# EAGLE design decoder (EAGLE 7.2.0)
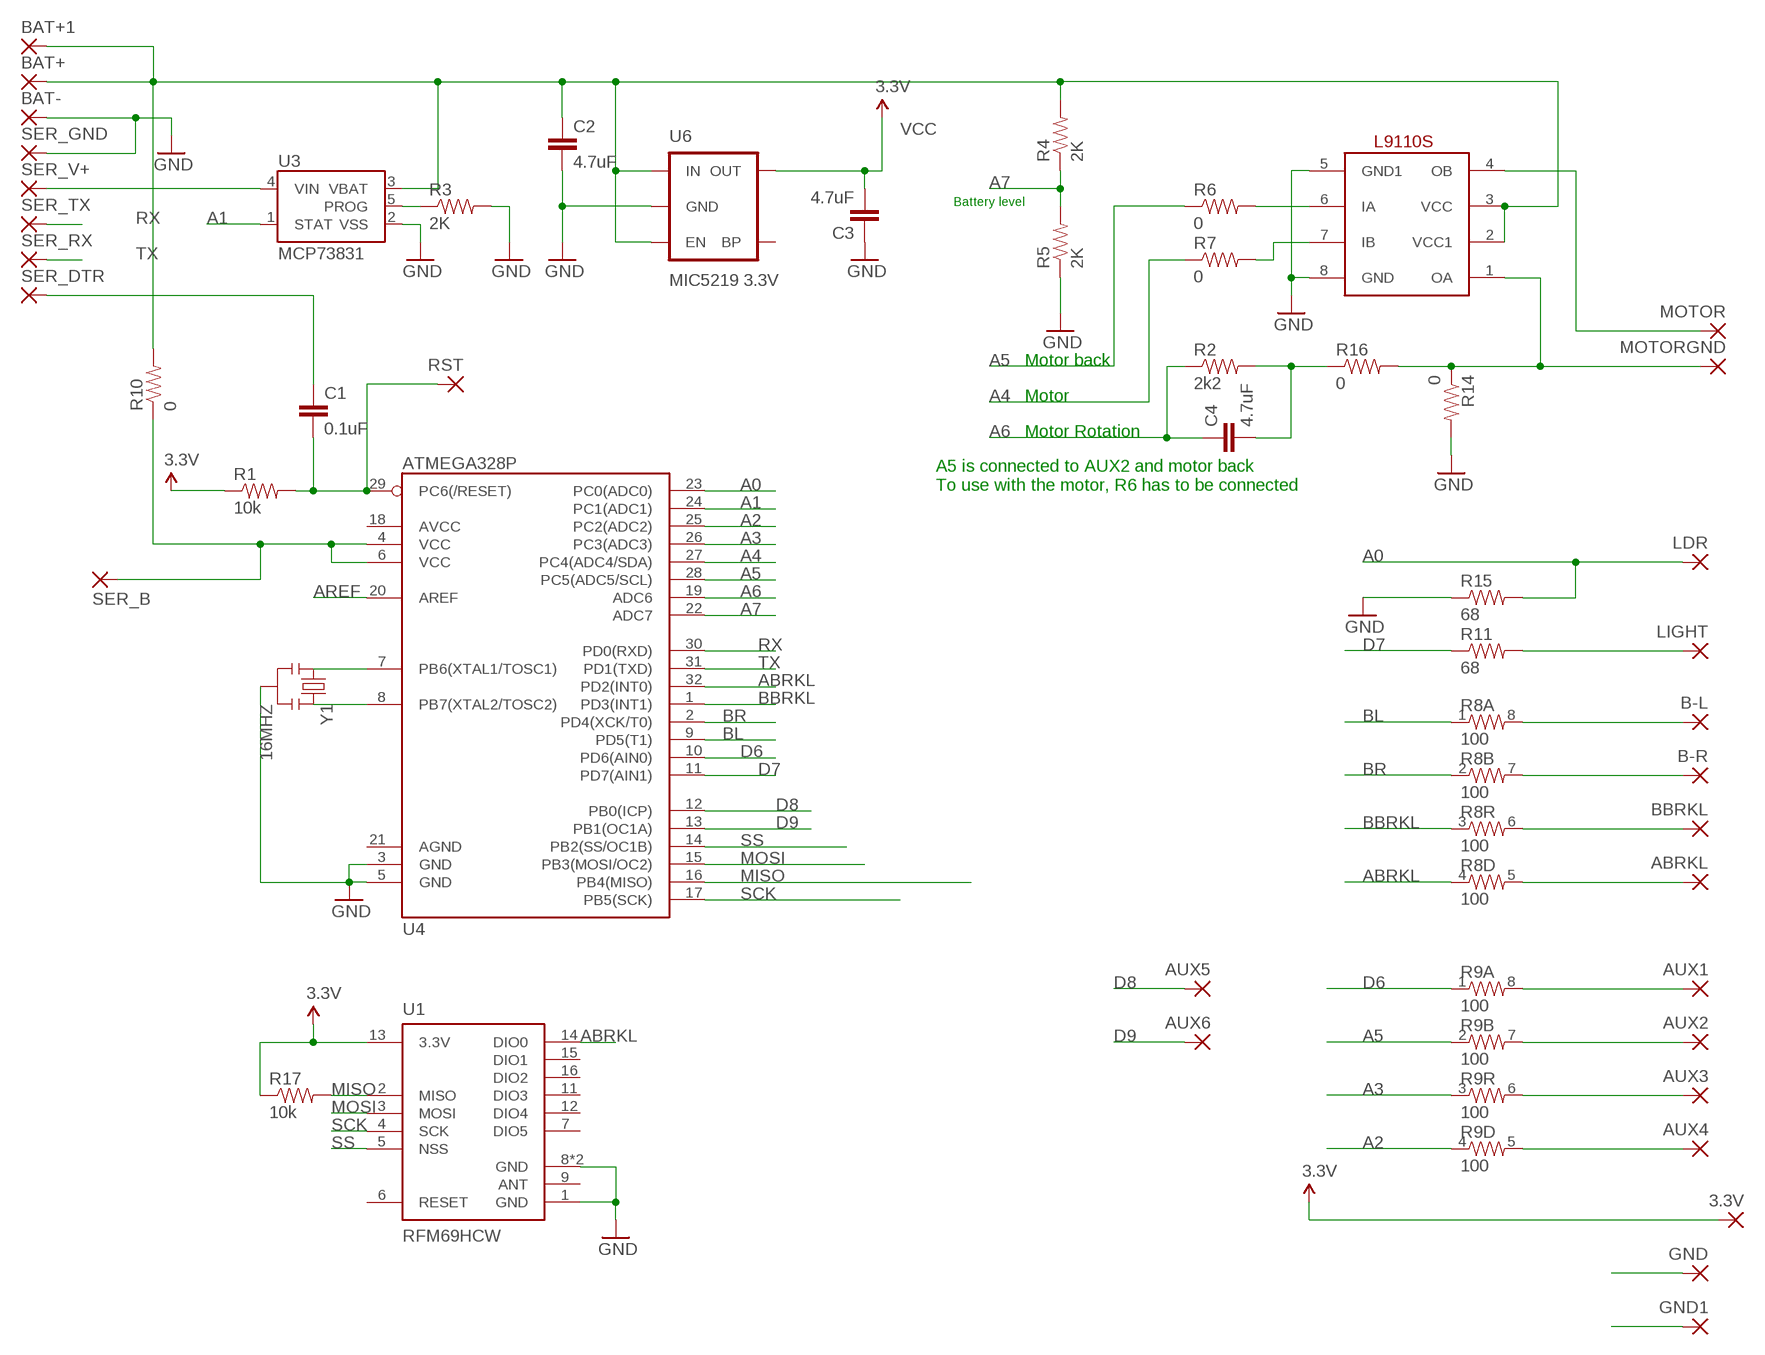
[diagram p0: schematic, sheet 1]

## Parts
3.3V  SMD2  [SMD1,27-2,54]
ABRKL  SMD2  [SMD1,27-2,54]
AUX1  SMD2  [SMD1,27-2,54]
AUX2  SMD2  [SMD1,27-2,54]
AUX3  SMD2  [SMD1,27-2,54]
AUX4  SMD2  [SMD1,27-2,54]
AUX5  SMD2  [SMD1,27-2,54]
AUX6  SMD2  [SMD1,27-2,54]
B-L  SMD2  [SMD1,27-2,54]
B-R  SMD2  [SMD1,27-2,54]
BAT+  SMD2  [SMD1,27-2,54]
BAT+1  SMD2  [SMD1,27-2,54]
BAT-  SMD2  [SMD1,27-2,54]
BBRKL  SMD2  [SMD1,27-2,54]
C1  0.1uF  CAP0805  [0805]
C2  4.7uF  CAP0805  [0805]
C3  4.7uF  CAP0805  [0805]
C4  4.7uF  CAP0805  [0805]
GND  SMD2  [SMD1,27-2,54]
GND1  SMD2  [SMD1,27-2,54]
LDR  SMD2  [SMD1,27-2,54]
LIGHT  SMD2  [SMD1,27-2,54]
MDRIVER  L9110S  [SO08]
MOTOR  SMD2  [SMD1,27-2,54]
MOTORGND  SMD2  [SMD1,27-2,54]
R1  10k  RESISTOR0603-RES  [0603-RES]
R2  2k2  RESISTOR0603-RES  [0603-RES]
R3  2K  RESISTOR0603-RES  [0603-RES]
R4  2K  RESISTOR0603-RES  [0603-RES]
R5  2K  RESISTOR0603-RES  [0603-RES]
R6  0  RESISTOR0603-RES  [0603-RES]
R7  0  RESISTOR0603-RES  [0603-RES]
R8  100  RESISTOR-ARRAY0603-ARV  [0603-ARV]
R9  100  RESISTOR-ARRAY0603-ARV  [0603-ARV]
R10  0  RESISTOR0603-RES  [0603-RES]
R11  68  RESISTOR0603-RES  [0603-RES]
R14  0  RESISTOR0603-RES  [0603-RES]
R15  68  RESISTOR0603-RES  [0603-RES]
R16  0  RESISTOR0603-RES  [0603-RES]
R17  10k  RESISTOR0603-RES  [0603-RES]
RST  SMD2  [SMD1,27-2,54]
SER_B  SMD2  [SMD1,27-2,54]
SER_DTR  SMD2  [SMD1,27-2,54]
SER_GND  SMD2  [SMD1,27-2,54]
SER_RX  SMD2  [SMD1,27-2,54]
SER_TX  SMD2  [SMD1,27-2,54]
SER_V+  SMD2  [SMD1,27-2,54]
U1  RFM69HCW  [RFM69HCW-XXXS2]
U3  MCP73831  [SOT23-5]
U4  ATMEGA328P  ATMEGA328_SMT  [TQFP32-08]
U6  MIC5219 3.3V  V_REG_MIC52193.3V  [SOT23-5]
Y1  16MHZ  RESONATOR16MHZ  [RESONATOR-SMD]

## Nets
A0: LDR.1(P) R15.2 U4.23(PC0(ADC0))
A1: U3.1(STAT) U4.24(PC1(ADC1))
A2: R9.4 U4.25(PC2(ADC2))
A3: R9.3 U4.26(PC3(ADC3))
A4: R7.1 U4.27(PC4(ADC4/SDA))
A5: R6.1 R9.2 U4.28(PC5(ADC5/SCL))
A6: C4.1 R2.1 U4.19(ADC6)
A7: R4.1 R5.2 U4.22(ADC7)
ABRKL: R8.4 U1.14(DIO0) U4.32(PD2(INT0))
AREF: U4.20(AREF)
BAT+: BAT+1.1(P) BAT+.1(P) C2.1 MDRIVER.2(VCC1) MDRIVER.3(VCC) R4.2 R10.2 U3.3(VBAT) U6.1(IN) U6.3(EN)
BBRKL: R8.3 U4.1(PD3(INT1))
BL: R8.1 U4.9(PD5(T1))
BR: R8.2 U4.2(PD4(XCK/T0))
D6: R9.1 U4.10(PD6(AIN0))
D7: R11.1 U4.11(PD7(AIN1))
D8: AUX5.1(P) U4.12(PB0(ICP))
D9: AUX6.1(P) U4.13(PB1(OC1A))
GND: BAT-.1(P) C2.2 C3.1 GND1.1(P) GND.1(P) MDRIVER.5(GND1) MDRIVER.8(GND) R3.2 R5.1 R14.2 R15.1 SER_GND.1(P) U1.1(GND) U1.8(GND) U1.10(GND) U3.2(VSS) U4.3(GND) U4.5(GND) U6.2(GND) Y1.2
MISO: R17.2 U1.2(MISO) U4.16(PB4(MISO))
MOSI: U1.3(MOSI) U4.15(PB3(MOSI/OC2))
N$1: C4.2 R2.2 R16.1
N$2: U4.7(PB6(XTAL1/TOSC1)) Y1.1
N$3: C1.1 SER_DTR.1(P)
N$4: U4.8(PB7(XTAL2/TOSC2)) Y1.3
N$5: C1.2 R1.2 RST.1(P) U4.29(PC6(/RESET))
N$6: MDRIVER.6(IA) R6.2
N$7: MDRIVER.7(IB) R7.2
N$8: R10.1 SER_B.1(P) U4.4(VCC) U4.6(VCC)
N$9: SER_V+.1(P) U3.4(VIN)
N$11: R3.1 U3.5(PROG)
N$12: LIGHT.1(P) R11.2
N$13: B-L.1(P) R8.8
N$16: B-R.1(P) R8.7
N$18: BBRKL.1(P) R8.6
N$20: ABRKL.1(P) R8.5
N$21: AUX1.1(P) R9.8
N$22: AUX2.1(P) R9.7
N$23: AUX3.1(P) R9.6
N$24: AUX4.1(P) R9.5
OA: MDRIVER.1(OA) MOTORGND.1(P) R14.1 R16.2
OB: MDRIVER.4(OB) MOTOR.1(P)
RX: SER_TX.1(P) U4.30(PD0(RXD))
SCK: U1.4(SCK) U4.17(PB5(SCK))
SS: U1.5(NSS) U4.14(PB2(SS/OC1B))
TX: SER_RX.1(P) U4.31(PD1(TXD))
VCC: 3.3V.1(P) C3.2 R1.1 R17.1 U1.13(3.3V) U6.5(OUT) ; supply symbol labelled 3.3V
Unconnected: U1.6(RESET) U1.7(DIO5) U1.9(ANT) U1.11(DIO3) U1.12(DIO4) U1.15(DIO1) U1.16(DIO2) U4.18(AVCC) U4.21(AGND) U6.4(BP)

## Notes on the sheet
- Battery level
- Motor back
- Motor
- Motor Rotation
- A5 is connected to AUX2 and motor back
  To use with the motor, R6 has to be connected

## Library data of the parts
3.3V ABRKL AUX1-AUX6 B-L B-R BAT+ BAT+1 BAT- BBRKL GND GND1 LDR LIGHT MOTOR MOTORGND RST SER_B SER_DTR SER_GND SER_RX SER_TX SER_V+ = wirepad:SMD2: SMD PAD
C1-C4 = SparkFun-Capacitors:CAP: Capacitor Standard 0603 ceramic capacitor, and 0.1" leaded capacitor.
MDRIVER = h-bridge-l9119s:L9110S: H Bridge L9110s
R1-R7 R10 R11 R14-R17 = SparkFun-Resistors:RESISTOR: Resistor Basic schematic elements and footprints for 0603, 1206, and PTH resistors.
R8 R9 = SparkFun-Resistors:RESISTOR-ARRAY: Array Chip Resistor Source: RS Component / Phycomp
U1 = SparkFun-RF:RFM69H
U3 = SparkFun-PowerIC:MCP73831: Miniature single cell, fully integrated Li-Ion, Li-polymer charge management controller http://ww1.microchip.com/downloads/en/DeviceDoc/21984a.pdf IC-09995; PROD_ID: IC-09995
U4 = SparkFun-DigitalIC:ATMEGA328_SMT: 32-Pin Atmega328 part Commonly used on Arduino compatible boards Available in QFP and QFN packages TQFP is IC-09069 QFN is non-stock; PROD_ID: IC-09069
U6 = SparkFun-PowerIC:V_REG_MIC5219: V_REG MIC5219 Standard 3.3V and 5V 500mA LDO voltage regulator in SOT-23 layout. Micrel part MIC5219. BP (by-pass) pin is used to lower output noise with 470pF cap, may be left open.; PROD_ID: VREG-09872
Y1 = SparkFun-FreqCtrl:RESONATOR: Resonator Small SMD resonator. Used, eg, on the Arduino Pro/ Pro Mini boards. 8MHz- XTAL-08895 16MHz- XTAL-08900; PROD_ID: XTAL-08900

## Board
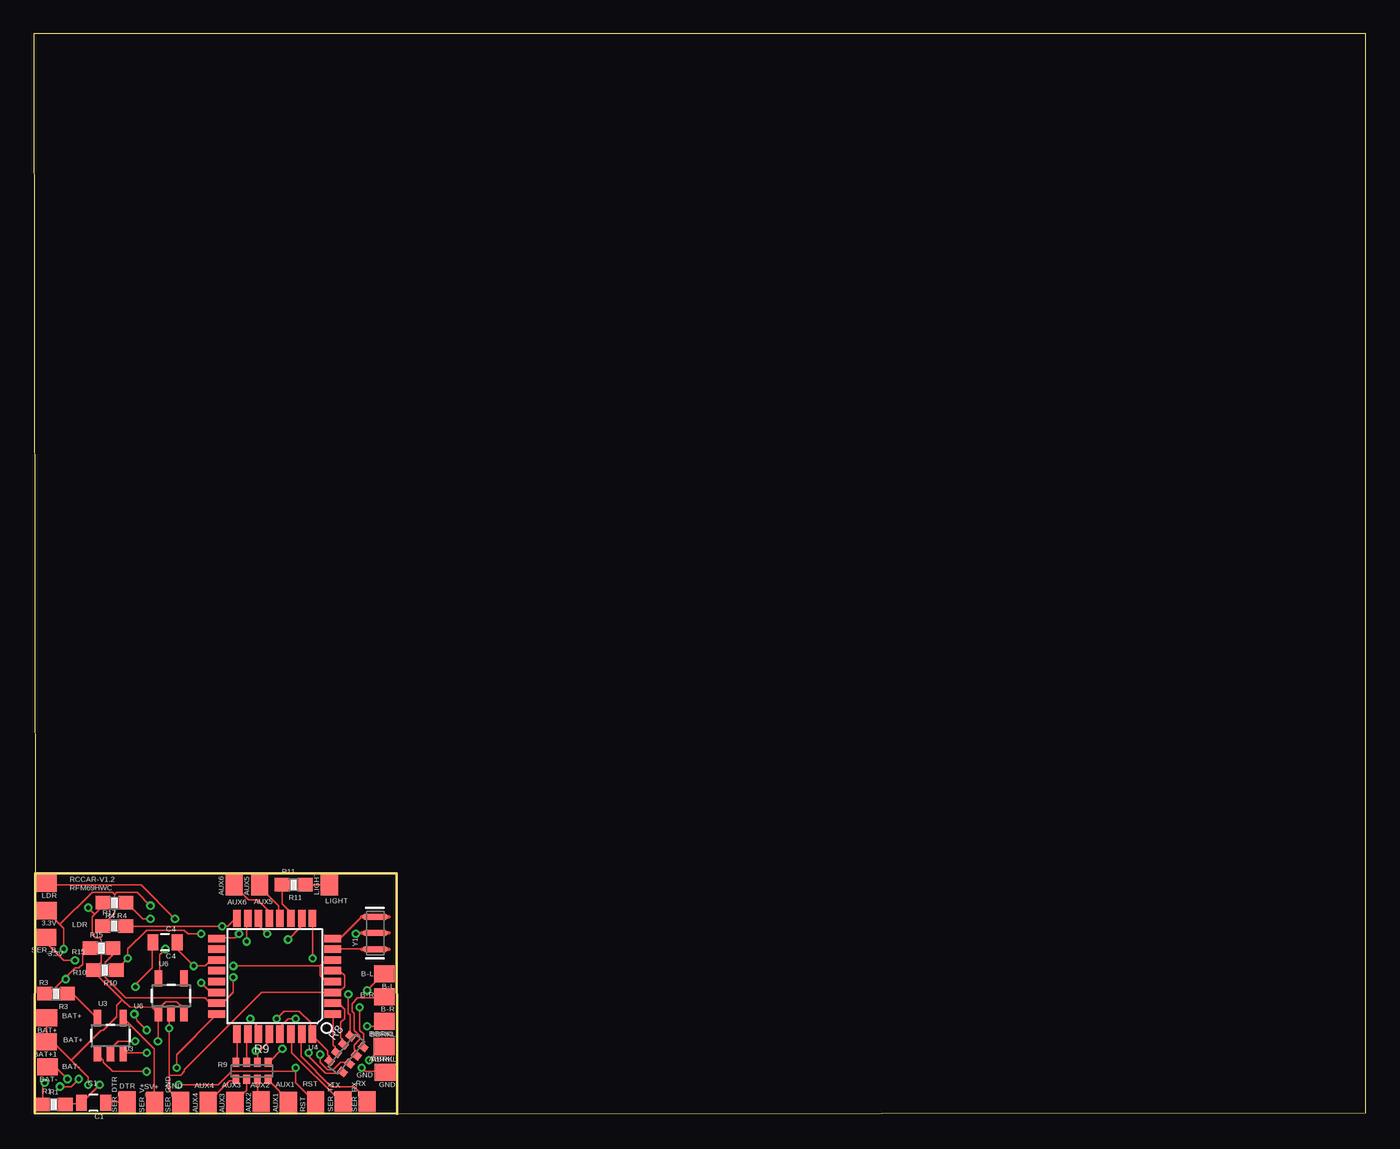
[diagram p1: board, top side]
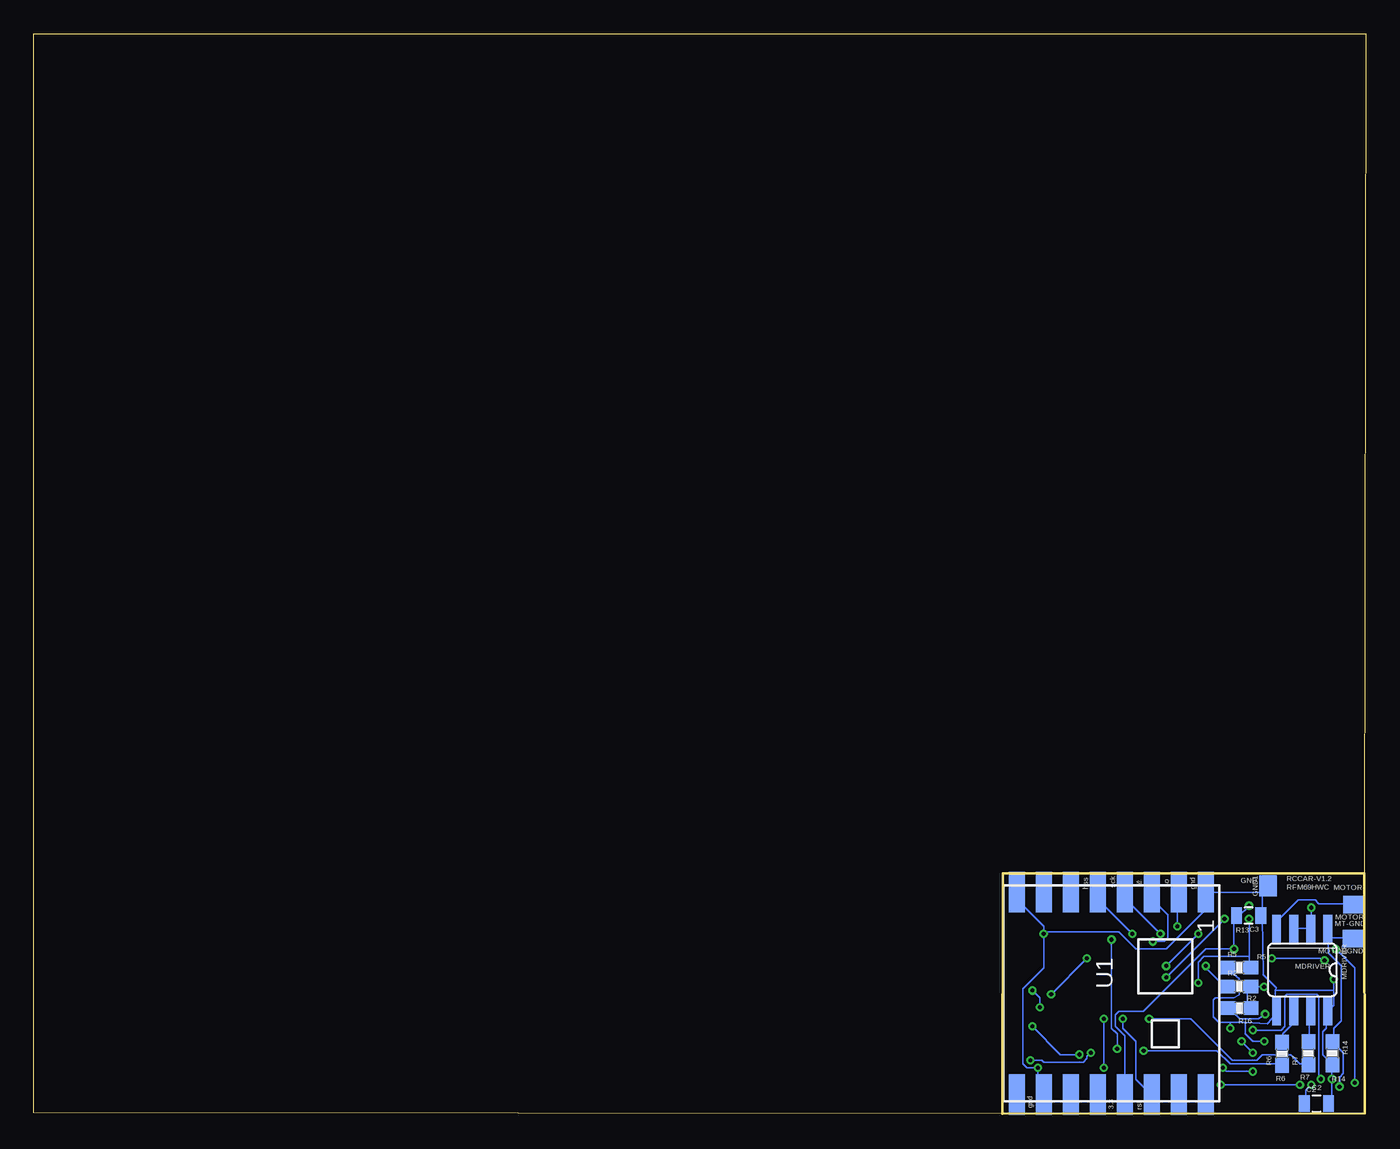
[diagram p2: board, bottom side, seen from below]

Size 98.73 x 80.04 mm. Coordinates in mm from the lower left corner, seen from the top.
Outline: 26.93,0 98.73,0.04 98.73,80.04 0,80.04 0.11,17.79
Outline: 0.11,17.79 26.91,17.8 26.93,0
Outline: 26.93,0 0.09,0.02 0.11,17.79
Copper layers (1*16): Top 0.035mm / dielectric 1.5mm / Bottom 0.035mm
Design rules "Elecrow_2-layer_eagle_rule *": minimum track width 5mil, minimum drill 12mil, track to track 6mil, track to pad 6mil, pad to pad 6mil, via to via 6mil, smd to smd 0mil, copper to edge 10mil, drill to drill 10mil, minimum pad ring 10mil, minimum via ring 6mil, stop-mask expansion 2mil, vias tented up to drill 100mil, thermal gap 10mil

### Footprints (pad centres in the part's own frame; a part is rotated, then mirrored left to right if it is on the bottom)
SMD1,27-2,54 = smd 1.27 x 1.524: 1 0,0
0805 = smd 0.8 x 1.2: 1 -0.9,0; 2 0.9,0
SO08 = smd 0.66 x 2.032: 1 -1.905,-3.073; 2 -0.635,-3.073; 3 0.635,-3.073; 4 1.905,-3.073; 5 1.905,3.073; 6 0.635,3.073; 7 -0.635,3.073; 8 -1.905,3.073
0603-RES = smd 1.1 x 1: 1 -0.85,0; 2 0.85,0
0603-ARV = smd 0.5 x 0.65: 1 -1.2,-0.625; 2 -0.4,-0.625; 3 0.4,-0.625; 4 1.2,-0.625; 5 1.2,0.625; 6 0.4,0.625; 7 -0.4,0.625; 8 -1.2,0.625
RFM69HCW-XXXS2 = smd 3 x 1.2: 1 -7.5,7; 2 -7.5,5; 3 -7.5,3; 4 -7.5,1; 5 -7.5,-1; 6 -7.5,-3; 7 -7.5,-5; 8 -7.5,-7; 9 7.5,-7; 10 7.5,-5; 11 7.5,-3; 12 7.5,-1; 13 7.5,1; 14 7.5,3; 15 7.5,5; 16 7.5,7
SOT23-5 = smd 0.55 x 1.2: 1 -0.95,-1.3; 2 0,-1.3; 3 0.95,-1.3; 4 0.95,1.3; 5 -0.95,1.3
TQFP32-08 = smd 1.27 x 0.559: 1 -4.293,2.8; 2 -4.293,2; 3 -4.293,1.2; 4 -4.293,0.4; 5 -4.293,-0.4; 6 -4.293,-1.2; 7 -4.293,-2; 8 -4.293,-2.8; 17 4.293,-2.8; 18 4.293,-2; 19 4.293,-1.2; 20 4.293,-0.4; 21 4.293,0.4; 22 4.293,1.2; 23 4.293,2; 24 4.293,2.8 | smd 0.559 x 1.27: 9 -2.8,-4.293; 10 -2,-4.293; 11 -1.2,-4.293; 12 -0.4,-4.293; 13 0.4,-4.293; 14 1.2,-4.293; 15 2,-4.293; 16 2.8,-4.293; 25 2.8,4.293; 26 2,4.293; 27 1.2,4.293; 28 0.4,4.293; 29 -0.4,4.293; 30 -1.2,4.293; 31 -2,4.293; 32 -2.8,4.293
RESONATOR-SMD = smd 0.45 x 1.905: 1 -1.2,0; 2 0,0; 3 1.2,0

### Placement (x,y rotation side)
3.3V  0.93,15.05 90 top
ABRKL  25.97,4.97 90 top
AUX1  18.87,0.87 0 top
AUX2  16.86,0.88 0 top
AUX3  14.91,0.85 0 top
AUX4  12.92,0.85 0 top
AUX5  16.74,16.94 0 top
AUX6  14.85,16.94 0 top
B-L  25.98,10.35 90 top
B-R  25.98,8.67 90 top
BAT+  0.97,7.1 90 top
BAT+1  0.96,5.33 90 top
BAT-  1.01,3.46 90 top
BBRKL  25.98,6.83 90 top
C1  4.44,0.8 180 top
C2  3.66,0.74 0 bottom
C3  8.68,14.67 180 bottom
C4  9.73,12.69 180 top
GND  26.04,3.06 90 top
GND1  7.25,16.88 0 bottom
LDR  0.95,17.08 90 top
LIGHT  21.91,16.95 0 top
MDRIVER  4.71,10.64 180 bottom
MOTOR  0.91,15.49 90 bottom
MOTORGND  0.94,12.97 90 bottom
R1  1.49,0.68 0 top
R2  9.37,9.43 0 bottom
R3  1.66,8.88 180 top
R4  5.98,15.62 180 top
R5  9.38,10.82 0 bottom
R6  6.2,4.44 90 bottom
R7  4.26,4.46 90 bottom
R8  23.18,4.42 230 top
R9  16.18,3.18 180 top
R10  5.27,10.64 180 top
R11  19.26,16.96 0 top
R14  2.48,4.46 270 bottom
R15  5.03,12.26 0 top
R16  9.35,7.81 180 bottom
R17  5.96,13.91 0 top
RST  20.89,0.88 0 top
SER_B  0.92,13.05 90 top
SER_DTR  6.93,0.88 0 top
SER_GND  10.9,0.86 0 top
SER_RX  24.72,0.89 0 top
SER_TX  22.94,0.9 0 top
SER_V+  8.96,0.85 0 top
U1  18.86,8.9 270 bottom
U3  5.68,5.78 0 top
U4  17.86,10.18 180 top
U6  10.18,8.73 0 top
Y1  25.31,13.38 90 top

### Tracks (layer width: path | path; a pad name or v marks a point on that pad's centre or on a via)
A0  (via drill 0.3)
  Top 0.127: R15.2 5.86,12.2 5.86,11.78 5.3,11.22 5.3,10.1 6.83,8.56 12.7,8.56 12.98,8.28 13.54,8.28 U4.23 13.68,8.28 14.1,8.28 14.8,8.98 v14.8,10.1 | v10.46,14.43 7.95,16.95 0.96,16.95 LDR.1
  Bottom 0.127: v14.8,10.1 v10.46,14.43
A1  (via drill 0.3)
  Top 0.127: v8.37,3.12 5.86,3.12 5.16,3.81 5.16,3.95 4.74,4.37 U3.1 | v10.6,3.4 10.6,4.37 13.54,7.31 U4.24
  Bottom 0.127: v8.37,3.12 10.33,3.12 v10.6,3.4
A2
  Top 0.127: R9.4 15.07,3.81 15.07,5.77 U4.25
A3
  Top 0.127: R9.3 15.77,3.81 15.77,5.77 U4.26
A4  (via drill 0.3)
  Top 0.127: v16.05,7.03 16.61,6.47 16.61,5.91 U4.27
  Bottom 0.127: v16.05,7.03 12.98,7.03 9.91,3.95 8.09,3.95 7.67,4.37 5.57,4.37 4.88,3.67 4.32,3.67 R7.1
A5  (via drill 0.3)
  Top 0.127: 16.61,4.51 16.61,3.81 R9.2 | 16.61,4.51 17.45,5.35 17.45,5.77 U4.28 | 16.61,4.51 v16.47,4.65
  Bottom 0.127: v16.47,4.65 11.02,4.65 10.05,3.67 6.27,3.67 R6.1
A6  (via drill 0.3)
  Top 0.127: U4.19 13.54,11.36 13.12,11.36 12.7,10.94 v11.86,10.94 10.74,12.06 10.74,12.62 C4.1
  Bottom 0.127: v11.86,10.94 11.86,10.8 10.46,9.4 R2.1
A7  (via drill 0.3)
  Top 0.127: v8.65,14.43 8.09,14.43 6.97,15.55 R4.1 | v12.42,9.68 12.98,9.12 13.54,9.12 U4.22
  Bottom 0.127: v8.65,14.43 8.65,11.64 | 8.65,11.64 8.65,10.94 R5.2 | v12.42,9.68 12.42,11.22 12,11.64 8.65,11.64
ABRKL  (via drill 0.3)
  Top 0.127: R8.4 21.92,3.95 21.92,4.23 21.78,4.37 21.78,4.65 20.66,5.77 U4.32 20.52,5.91 20.52,6.75 19.68,7.59 18.57,7.59 v18.01,7.03
  Bottom 0.127: v18.01,7.03 18.01,6.33 17.03,5.35 17.03,2.56 15.91,1.44 U1.14
BAT+  (via drill 0.3)
  Top 0.127: v4.04,2.14 4.04,2.7 2.78,3.95 | 2.78,3.95 1.52,5.21 0.96,5.21 BAT+1.1 0.96,5.35 0.96,7.03 BAT+.1 | 6.55,8.42 7.11,7.91 8.79,7.87 9.07,7.59 | 6.55,8.42 4.46,10.52 R10.2 4.46,10.66 5.02,11.22 5.02,12.89 4.88,13.03 4.6,13.03 4.32,13.31 4.32,14.57 4.6,14.85 | 9.07,7.59 9.21,7.45 U6.1 | 4.6,14.85 5.02,15.27 5.02,15.55 R4.2 | v8.37,4.51 6.69,4.51 U3.3 | v9.21,5.35 9.21,7.31 U6.1 | 9.07,7.59 9.77,8.28 10.6,8.28 11.02,7.87 11.02,7.45 U6.3 | 9.07,7.59 U6.1 | v4.04,15.27 4.46,14.85 4.6,14.85 | 2.78,3.95 5.02,6.19 5.16,6.19 6.13,7.17 6.13,8.01 6.55,8.42
  Bottom 0.127: v4.04,2.14 4.46,1.72 4.46,0.74 C2.1 | MDRIVER.3 5.3,13.73 4.18,13.73 MDRIVER.2 4.04,13.73 v4.04,15.27 | v9.21,5.35 v8.37,4.51
BBRKL
  Top 0.127: R8.3 22.34,4.51 22.34,4.93 22.2,5.07 22.2,7.31 U4.1
BL  (via drill 0.3)
  Top 0.127: v23.32,8.84 23.32,7.45 23.46,7.31 23.46,5.77 R8.1 | v20.66,11.5 20.66,14.43 U4.9
  Bottom 0.127: v20.66,11.5 v23.32,8.84
BR
  Top 0.127: R8.2 22.9,5.21 22.9,5.49 22.76,5.63 22.76,6.75 23.04,7.03 23.04,7.73 22.62,8.15 22.2,8.15 U4.2
D6  (via drill 0.3)
  Top 0.127: v18.43,4.79 17.45,3.81 R9.1 | v18.85,12.89 19.82,13.87 19.82,14.43 U4.10
  Bottom 0.127: v18.43,4.79 18.43,5.91 18.85,6.33 v18.85,12.89
D7
  Top 0.127: R11.1 18.43,16.95 18.43,15.55 18.99,14.99 18.99,14.57 U4.11
D8
  Top 0.127: U4.12 18.15,14.57 18.15,15.41 16.75,16.81 AUX5.1
D9
  Top 0.127: U4.13 17.45,14.57 17.45,14.99 16.61,15.83 15.91,15.83 14.93,16.81 AUX6.1
GND  (via drill 0.3)
  Top 0.127: v23.88,13.31 24.3,13.31 24.29,13.38 | v24.3,3.4 24.57,3.12 25.97,3.12 GND.1 | U4.5 22.2,10.52 22.76,10.52 23.04,10.24 23.04,9.4 22.76,9.12 22.2,9.12 U4.3 22.06,8.98 16.89,8.98 11.16,3.26 11.16,3.12 10.88,2.84 10.05,2.84 | 10.05,2.84 10.05,1.72 10.88,0.88 SER_GND.1 | 10.05,2.84 v10.05,6.33 10.05,7.31 U6.2 | 2.22,9.96 3.06,10.8 3.34,10.8 3.62,11.08 3.62,11.78 4.04,12.2 R15.1 | 2.22,9.96 1.25,8.98 0.83,8.98 R3.2 | v2.5,2.56 1.66,3.4 1.1,3.4 BAT-.1 | v2.36,9.96 2.22,9.96 | v7.53,5.35 6.27,5.35 5.71,4.79 5.71,4.51 U3.2
  Bottom 0.127: 23.88,13.45 23.88,13.87 25.83,15.83 25.83,16.39 U1.8 | U1.10 23.88,1.44 24.3,1.86 v24.3,3.4 25.13,3.4 25.41,3.67 25.41,9.26 23.88,10.8 v23.88,13.31 23.88,13.45 | C2.2 2.64,0.74 2.5,0.88 v2.5,2.56 2.5,3.54 R14.2 2.5,3.67 3.2,4.37 3.2,6.05 2.92,6.33 2.92,7.45 MDRIVER.8 2.78,7.59 2.36,8.01 2.36,9.12 | 2.36,9.12 v2.36,9.96 | 7.67,16.39 7.67,14.71 C3.1 7.67,14.57 7.59,10.29 6.61,9.32 6.69,9.12 | 7.67,16.39 7.25,16.81 GND1.1 7.67,16.39 | 7.67,16.39 11.86,16.39 U1.1 12,16.39 12,14.99 14.8,12.2 17.03,12.2 18.29,13.45 23.88,13.45 | 8.93,6.75 7.3,6.65 6.63,7.4 MDRIVER.5 6.69,7.59 6.69,9.12 | 8.93,6.75 10.05,6.75 | 10.05,6.75 10.88,6.75 11.3,7.17 11.3,8.42 11.16,8.56 9.77,8.57 9.39,8.8 9.39,9.97 10.33,10.8 R5.1 | v7.53,5.35 8.37,5.35 8.93,5.91 8.93,6.75 | 6.69,9.12 2.36,9.12 | 10.05,6.75 v10.05,6.33
MISO  (via drill 0.3)
  Top 0.127: R17.2 6.83,13.87 v13.96,13.87 14.38,13.87 14.93,14.43 U4.16
  Bottom 0.127: v13.96,13.87 13.96,16.39 U1.2
MOSI  (via drill 0.3)
  Top 0.127: v15.77,12.76 15.77,14.43 U4.15
  Bottom 0.127: v15.77,12.76 14.93,12.76 14.66,13.03 14.66,14.71 15.77,15.83 15.77,16.39 U1.3
N$1  (via drill 0.3)
  Top 0.127: v7.54,9.4 7.67,9.68 8.79,10.8 8.79,12.62 C4.2
  Bottom 0.127: R16.1 8.79,7.87 8.79,9.26 R2.2 8.65,9.4 v7.54,9.4
N$2
  Top 0.127: U4.7 22.2,12.2 24.3,12.2 24.29,12.18
N$3
  Top 0.127: C1.1 5.44,0.88 6.83,0.88 SER_DTR.1
N$4
  Top 0.127: U4.8 22.2,13.03 22.76,13.03 24.3,14.57 24.29,14.58
N$5  (via drill 0.3)
  Top 0.127: R1.2 2.36,0.74 3.48,0.74 C1.2 3.62,0.88 v4.88,2.14 | v19.41,7.03 18.85,7.03 18.29,6.47 18.29,5.91 U4.29 | 19.41,3.12 19.41,2.28 20.8,0.88 RST.1 | v10.74,2.14 13.68,2.14 14.66,3.12 19.41,3.12 | 19.41,3.12 v19.41,3.4
  Bottom 0.127: v19.41,3.4 v19.41,7.03 | v10.74,2.14 v4.88,2.14
N$6
  Bottom 0.127: R6.2 6.13,5.35 6.13,5.91 5.44,6.61 5.44,7.45 MDRIVER.6
N$7
  Bottom 0.127: R7.2 4.18,5.35 4.18,7.45 MDRIVER.7
N$8  (via drill 0.3)
  Top 0.127: 21.22,10.94 21.22,10.24 21.64,9.82 22.06,9.82 U4.4 | 21.22,10.94 21.64,11.36 22.06,11.36 U4.6 | v3.06,11.36 2.22,11.36 0.96,12.62 0.96,13.03 SER_B.1 | R10.1 6.13,10.66 v6.97,11.5 6.97,12.2 8.37,13.59 11.16,13.59 11.44,13.31 v12.42,13.31 | v14.8,10.94 21.22,10.94
  Bottom 0.127: v6.97,11.5 3.2,11.5 v3.06,11.36 | v12.42,13.31 v14.8,10.94
N$9
  Top 0.127: U3.4 6.69,7.03 8.93,4.79 8.93,0.88 SER_V+.1
N$11
  Top 0.127: R3.1 2.64,8.84 2.92,8.84 4.6,7.17 U3.5
N$12
  Top 0.127: R11.2 20.24,16.95 21.78,16.95 LIGHT.1
N$13  (via drill 0.3)
  Top 0.127: v24.16,7.87 24.16,6.19 24.43,5.91 24.43,5.07 R8.8 | v24.71,9.12 25.97,10.38 B-L.1
  Bottom 0.127: v24.16,7.87 24.16,8.56 v24.71,9.12
N$16
  Top 0.127: R8.7 23.88,4.37 23.88,4.65 23.74,4.79 23.74,5.07 24.16,5.49 24.16,5.77 23.74,6.19 23.74,7.45 23.6,7.59 23.6,8.15 24.02,8.56 25.97,8.56 B-R.1
N$18  (via drill 0.3)
  Top 0.127: v21.22,4.37 21.22,3.81 21.78,3.26 22.2,3.26 22.76,3.81 23.32,3.81 R8.6 | v24.71,6.47 25.69,6.47 25.97,6.75 BBRKL.1
  Bottom 0.127: v21.22,4.37 22.62,4.37 v24.71,6.47
N$20  (via drill 0.3)
  Top 0.127: v20.38,4.51 20.38,4.23 21.64,2.98 22.76,2.98 R8.5 | v24.85,3.95 25.83,4.93 ABRKL.1
  Bottom 0.127: v20.38,4.51 20.66,4.23 20.66,4.09 20.94,3.81 23.88,3.81 24.02,3.95 v24.85,3.95
N$21
  Top 0.127: R9.8 17.45,2.42 18.99,0.88 AUX1.1
N$22
  Top 0.127: R9.7 16.61,2.42 16.61,1.16 16.75,1.02 AUX2.1
N$23
  Top 0.127: R9.6 15.77,2.42 15.77,1.72 14.93,0.88 AUX3.1
N$24
  Top 0.127: R9.5 14.93,2.42 14.52,2.42 12.98,0.88 AUX4.1
OA  (via drill 0.3)
  Top 0.127: v7.46,7.37 7.67,6.89 v8.37,6.19 | v3.34,2.56 2.78,2 v1.94,2
  Bottom 0.127: 2.78,13.03 2.78,13.59 MDRIVER.1 2.78,13.03 | 2.78,13.03 2.78,11.92 1.8,10.94 1.8,6.89 2.36,6.33 2.36,5.35 R14.1 2.36,5.21 1.66,4.51 1.66,2.98 1.94,2.7 v1.94,2 | v7.46,7.37 7.95,7.03 9.35,7.03 10.05,7.73 10.46,7.73 R16.2 | v8.37,6.19 6.27,6.19 5.99,6.47 5.99,8.7 5.86,8.84 3.62,8.84 3.48,8.7 3.48,2.7 v3.34,2.56 | 2.78,13.03 0.96,13.03 MOTORGND.1
OB
  Bottom 0.127: MOTOR.1 0.96,15.55 3.48,15.55 3.76,15.83 5.02,15.83 6.55,14.29 6.55,13.73 MDRIVER.4
RX
  Top 0.127: U4.30 19.13,5.77 19.13,4.51 22.62,1.02 22.9,1.02 SER_TX.1
SCK  (via drill 0.3)
  Top 0.127: v15.21,13.31 14.93,13.03 13.68,13.03 U4.17
  Bottom 0.127: v15.21,13.31 17.73,15.83 17.73,16.39 U1.4
SS  (via drill 0.3)
  Top 0.127: v17.31,13.31 16.75,13.87 16.75,14.43 U4.14
  Bottom 0.127: v17.31,13.31 19.82,15.83 19.82,16.39 U1.5
TX
  Top 0.127: U4.31 19.82,5.77 19.82,4.23 22.06,2 23.74,2 24.71,1.02 SER_RX.1
VCC  (via drill 0.3)
  Top 0.127: v0.83,2.28 0.69,2.14 0.69,0.74 R1.1 | v2.22,12.2 2.22,13.73 1.94,14.01 | 1.94,14.01 0.96,14.99 3.3V.1 | 5.99,16.25 5.99,14.85 5.16,14.01 R17.1 | 5.99,16.25 5.86,16.39 4.32,16.39 1.94,14.01 | v9.77,12.2 9.35,11.78 9.35,10.1 U6.5 | 5.99,16.25 6.13,16.39 7.67,16.39 v8.65,15.41
  Bottom 0.127: v0.83,2.28 0.83,10.8 v2.22,12.2 | U1.13 17.87,1.44 17.87,5.77 18.57,6.47 18.57,7.31 18.29,7.59 16.47,7.59 11.86,12.2 v9.77,12.2 9.77,14.43 9.63,14.57 C3.2 9.49,14.57 v8.65,15.41

### Text on the board
_tsilk: RCCAR-V1.2 / RFM69HWC | R11 | LIGHT | AUX6 | AUX5 | LDR | R4 | C4 | 3.3V | R15 | R10 | B-L | R3 | B-R | U6 | BAT+ | BBRKL | BAT+ | U3 | ABRKL | BAT- | R9 | GND | C1 | DTR | SV+ | GND | AUX4 | AUX3 | AUX2 | AUX1 | RST | TX | RX | R1
_bsilk: RCCAR-V1.2 / RFM69HWC | GND | gnd | so | si | sck | hss | MOTOR | MT-GND | R13 | MDRIVER | R5 | R2 | R14 | C2 | R7 | R6 | rst | 3.3 | gnd